# Altium schematic sheet Voltage Regulator.SchDoc: Voltage Regulator
size A4; SheetNumber: 5; SheetTotal: 6
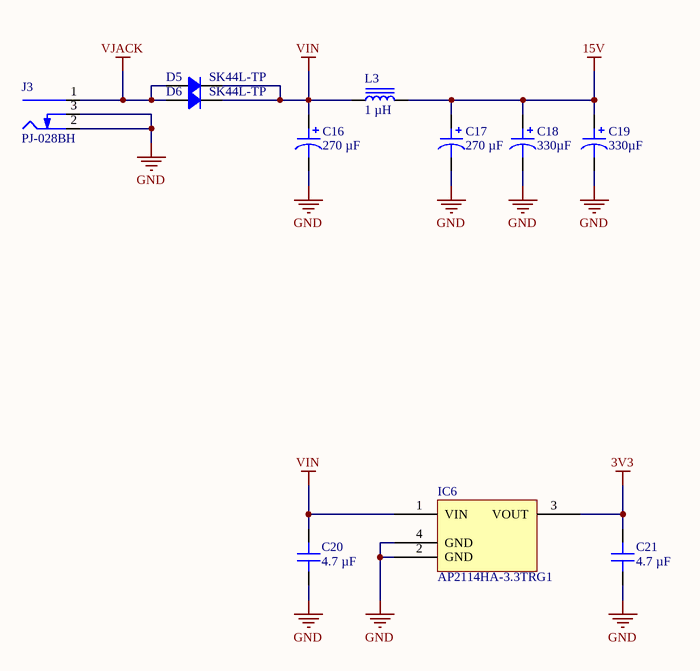
[diagram p0: Voltage Regulator.SchDoc]

## Parts
C16  270 µF  [CAP TH ALPOLY D10.00mm S5.00mm H14.00mm]
C17  270 µF  [CAP TH ALPOLY D10.00mm S5.00mm H14.00mm]
C18  330µF  [CAP TH ALUM ELEC D8.00mm S3.50mm H21.50mm]
C19  330µF  [CAP TH ALUM ELEC D8.00mm S3.50mm H21.50mm]
C20  4.7 µF  [CAP 0805_2012]
C21  4.7 µF  [CAP 0805_2012]
D5  SK44L-TP  [DO214AB SMC]
D6  SK44L-TP  [DO214AB SMC]
IC6  AP2114HA-3.3TRG1  [DIODES SOT-223]
J3  PJ-028BH  [CUI PJ-028BH]
L3  1 µH  [TAIYO YUDEN NRS8030]

## Nets
3V3: C21.2 IC6.3(VOUT)
15V: C17.1 C18.1 C19.1 L3.2
GND: C16.2 C17.2 C18.2 C19.2 C20.1 C21.1 IC6.2(GND) IC6.4(GND) J3.2(Outer) J3.3(SW)
VIN: C16.1 C20.2 D5.2 D6.2 IC6.1(VIN) L3.1
VJACK: D5.1 D6.1 J3.1(Centre)

## Notes on the sheet
- Title
- Size:
- Date:
- A4
- Number:
- Time:
- Revision:
- Sheet
- of
- File:

## Library data of the parts
C16 C17 = A759MU277M1VAAE022: CAP ALUM POLY 270UF 20% 35V TH; manufacturer: KEMET; ESR (Equivalent Series Resistance): 22mOhm; Lifetime @ Temp.: 2000 Hrs @ 125°C; Ripple Current @ High Frequency: 3.74 A @ 100 kHz; Ripple Current @ Low Frequency: 187 mA @ 120 Hz; Type: Polymer; Part Number: A759MU277M1VAAE022; Value: 270 µF; Applications: General Purpose; Capacitance: 270 µF; componentlink1description: Datasheet; componentlink1url: https://api.kemet.com/component-edge/download/datasheet/A759MU277M1VAAE022.pdf; componentlink2description: DigiKey Link; componentlink2url: https://www.digikey.com/en/products/detail/kemet/A759MU277M1VAAE022/13420072; Height - Seated (Max): 0.551" (14.00mm); lastupdated: 16/03/2022 07:18:21; Lead Spacing: 0.197" (5.00mm); Lifecycle Status: Active; Minimum Order: 1; Mounting Type: Through Hole; Operating Temperature: -55°C ~ 125°C; packaging: Bulk; partid: 4518; Part Status: Active; price: 0.26; series: A759; Size / Dimension: 0.394" Dia (10.00mm); Supplier 1: DigiKey; Supplier Part Number 1: 399-A759MU277M1VAAE022-ND; Tolerance: ±20%; Voltage - Rated: 35 V
C18 C19 = 860080574014: CAP ALUM 330UF 20% 35V THRU HOLE; manufacturer: Würth Elektronik; Impedance: 41 mOhms; Lifetime @ Temp.: 3000 Hrs @ 105°C; Polarization: Polar; Ripple Current @ High Frequency: 1.21A @ 100kHz; Part Number: 860080574014; Applications: General Purpose; Capacitance: 330µF; componentlink1description: Datasheet; componentlink1url: https://katalog.we-online.de/pbs/datasheet/860080574014.pdf; componentlink2description: DigiKey Link; componentlink2url: http://digikey.com/product-detail/en/w-rth-elektronik/860080574014/732-9106-1-ND/5729049; Device Package: Radial, Can; Height - Seated (Max): 0.846" (21.50mm); lastupdated: 08/09/2020 02:47:41; Lead Spacing: 0.138" (3.50mm); Lifecycle Status: Active; Minimum Order: 1; Mounting Type: Through Hole; Operating Temperature: -55°C ~ 105°C; Package / Case: Radial, Can; packaging: TapeAndBox; partid: 24697; Part Status: Active; price: 0.29; series: WCAP-ATLI; Size / Dimension: 0.315" Dia (8.00mm); Supplier 1: DigiKey; Supplier Part Number 1: 732-9106-1-ND; Tolerance: ±20%; value: 330µF; Voltage - Rated: 35V
C20 C21 = CL21A475KBQNNNE: CAP CER 4.7UF 50V X5R 0805; manufacturer: Samsung Electro-Mechanics; Tolerance: ±10%; Part Number: CL21A475KBQNNNE; Value: 4.7 µF; Applications: General Purpose; Capacitance: 4.7 µF; componentlink1description: Datasheet; componentlink1url: http://www.samsungsem.com/kr/support/product-search/mlcc/CL21A475KBQNNNE.jsp; componentlink2description: DigiKey Link; componentlink2url: https://www.digikey.com/en/products/detail/samsung-electro-mechanics/CL21A475KBQNNNE/3886906; Device Package: 0805 (2012 Metric); lastupdated: 16/03/2022 06:26:03; Lifecycle Status: Active; Minimum Order: 1; Mounting Type: Surface Mount, MLCC; Operating Temperature: -55°C ~ 85°C; Package / Case: 0805 (2012 Metric); packaging: TapeAndReel; partid: 3027; Part Status: Active; price: 0.04; series: CL; Size / Dimension: 0.079" L x 0.049" W (2.00mm x 1.25mm); Supplier 1: DigiKey; Supplier Part Number 1: 1276-1248-1-ND; Temperature Coefficient: X5R; Thickness (Max): 0.055" (1.40mm); Voltage - Rated: 50V
D5 D6 = SK44L-TP: DIODE SCHOTTKY 4A 40V SMC; Manufacturer: Micro Commercial Co; Current - Reverse Leakage @ Vr: 500 µA @ 40 V; Speed: Fast Recovery =< 500ns, > 200mA (Io); Voltage - Forward (Vf) (Max) @ If: 450 mV @ 4 A; Part Number: SK44L-TP; ComponentLink1Description: Datasheet; ComponentLink1URL: https://www.mccsemi.com/pdf/Products/SK42L-SK44L(DO-214AB).pdf; ComponentLink2Description: DigiKey Link; ComponentLink2URL: https://www.digikey.com/en/products/detail/micro-commercial-co/SK44L-TP/5418832; Current - Average Rectified (Io): 4A; Diode Type: Schottky; LastUpdated: 17/03/2022 08:59:56; Lifecycle Status: Active; Minimum Order: 1; Mounting Type: Surface Mount; Operating Temperature - Junction: -55°C ~ 125°C; Package / Case: DO-214AB, SMC; Packaging: TapeAndReel; PartId: 1693; Part Status: Active; Price: 0.15; Series: -; Supplier 1: DigiKey; Supplier Part Number 1: SK44L-TPMSCT-ND; Supplier Device Package: SMC (DO-214AB); Voltage - DC Reverse (Vr) (Max): 40 V
IC6 = AP2114HA-3.3TRG1: IC REG LINEAR 3.3V 1A SOT223; Manufacturer: Diodes Incorporated; Current - Quiescent (Iq): 90 µA; Number of Regulators: 1; Output Configuration: Positive; Output Type: Fixed; Protection Features: Over Current, Over Temperature; PSRR: 65dB (100Hz ~ 1kHz); Voltage Dropout (Max): 0.75V @ 1A; Voltage - Input (Max): 6V; Part Number: AP2114HA-3.3TRG1; ComponentLink1Description: Datasheet; ComponentLink1URL: https://www.diodes.com/assets/Datasheets/AP2114.pdf; ComponentLink2Description: DigiKey Link; ComponentLink2URL: https://www.digikey.com/en/products/detail/diodes-incorporated/AP2114HA-3-3TRG1/4770627; Current - Output: 1A; LastUpdated: 12/04/2022 23:08:40; Lifecycle Status: Active; Minimum Order: 1; Mounting Type: Surface Mount; Operating Temperature: -40°C ~ 85°C; Package / Case: TO-261-4, TO-261AA; Packaging: TapeAndReel; Part Status: Active; Price: 0.10; Series: -; Supplier 1: DigiKey; Supplier Part Number 1: AP2114HA-3.3TRG1DICT-ND; Supplier Device Package: SOT-223-3; Voltage - Output (Min/Fixed): 3.3V
J3 = PJ-028BH: CONN POWER JACK 2.5X5.5MM; Manufacturer: CUI Devices; Actual Diameter: 0.098" (2.50mm ID), 0.256" (6.50mm OD); Current Rating (Amps): 5 A; Gender: Male; Industry Recognized Mating Diameter: 2.50mm ID (0.098"), 5.50mm OD (0.217"); Internal Switch(s): Single Switch, Normally Closed; Material Flammability Rating: UL94 V-0; Mating Length/Depth: 0.354" (9.00mm); Number of Positions/Contacts: 2 Conductors, 3 Contacts; Shielding: Unshielded; Part Number: PJ-028BH; ComponentLink1Description: Datasheet; ComponentLink1URL: https://www.cuidevices.com/product/resource/digikeypdf/pj-028bh.pdf; ComponentLink2Description: DigiKey Link; ComponentLink2URL: https://www.digikey.com/en/products/detail/cui-devices/PJ-028BH/1644512; Connector Type: Jack; LastUpdated: 19/03/2022 04:09:31; Lifecycle Status: Active; Minimum Order: 1; Mounting Type: Through Hole; Packaging: Bag; Part Status: Active; Price: 0.56; Series: -; Supplier 1: DigiKey; Supplier Part Number 1: CP-028BH-ND; Termination: Kinked Pin
L3 = NRS8030T1R0NJGJ: FIXED IND 1UH 6.2A 11.7 MOHM SMD; Manufacturer: Taiyo Yuden; Current - Saturation: 7.8A; DC Resistance (DCR): 11.7mOhm Max; Frequency - Self Resonant: 120MHz; Inductance Frequency - Test: 100 kHz; Material - Core: Ferrite; Shielding: Shielded; Tolerance: ±30%; Type: Wirewound; Part Number: NRS8030T1R0NJGJ; ComponentLink1Description: Datasheet; ComponentLink1URL: https://www.yuden.co.jp/productdata/catalog/wound04_e.pdf; ComponentLink2Description: DigiKey Link; ComponentLink2URL: https://www.digikey.com/en/products/detail/taiyo-yuden/NRS8030T1R0NJGJ/2666000; Current Rating (Amps): 6.2 A; Device Package: Nonstandard; Height - Seated (Max): 0.118" (3.00mm); Inductance: 1 µH; LastUpdated: 16/03/2022 13:29:43; Lifecycle Status: Active; Minimum Order: 1; Mounting Type: Surface Mount; Operating Temperature: -25°C ~ 125°C; Package / Case: Nonstandard; Packaging: TapeAndReel; PartId: 5484; Part Status: Active; Price: 0.21; Series: NR, S Type; Size / Dimension: 0.315" L x 0.315" W (8.00mm x 8.00mm); Supplier 1: DigiKey; Supplier Part Number 1: 587-2962-1-ND; Value: 1 µH